# EAGLE design Mic-Breakout_v13 (EAGLE 7.7.0)
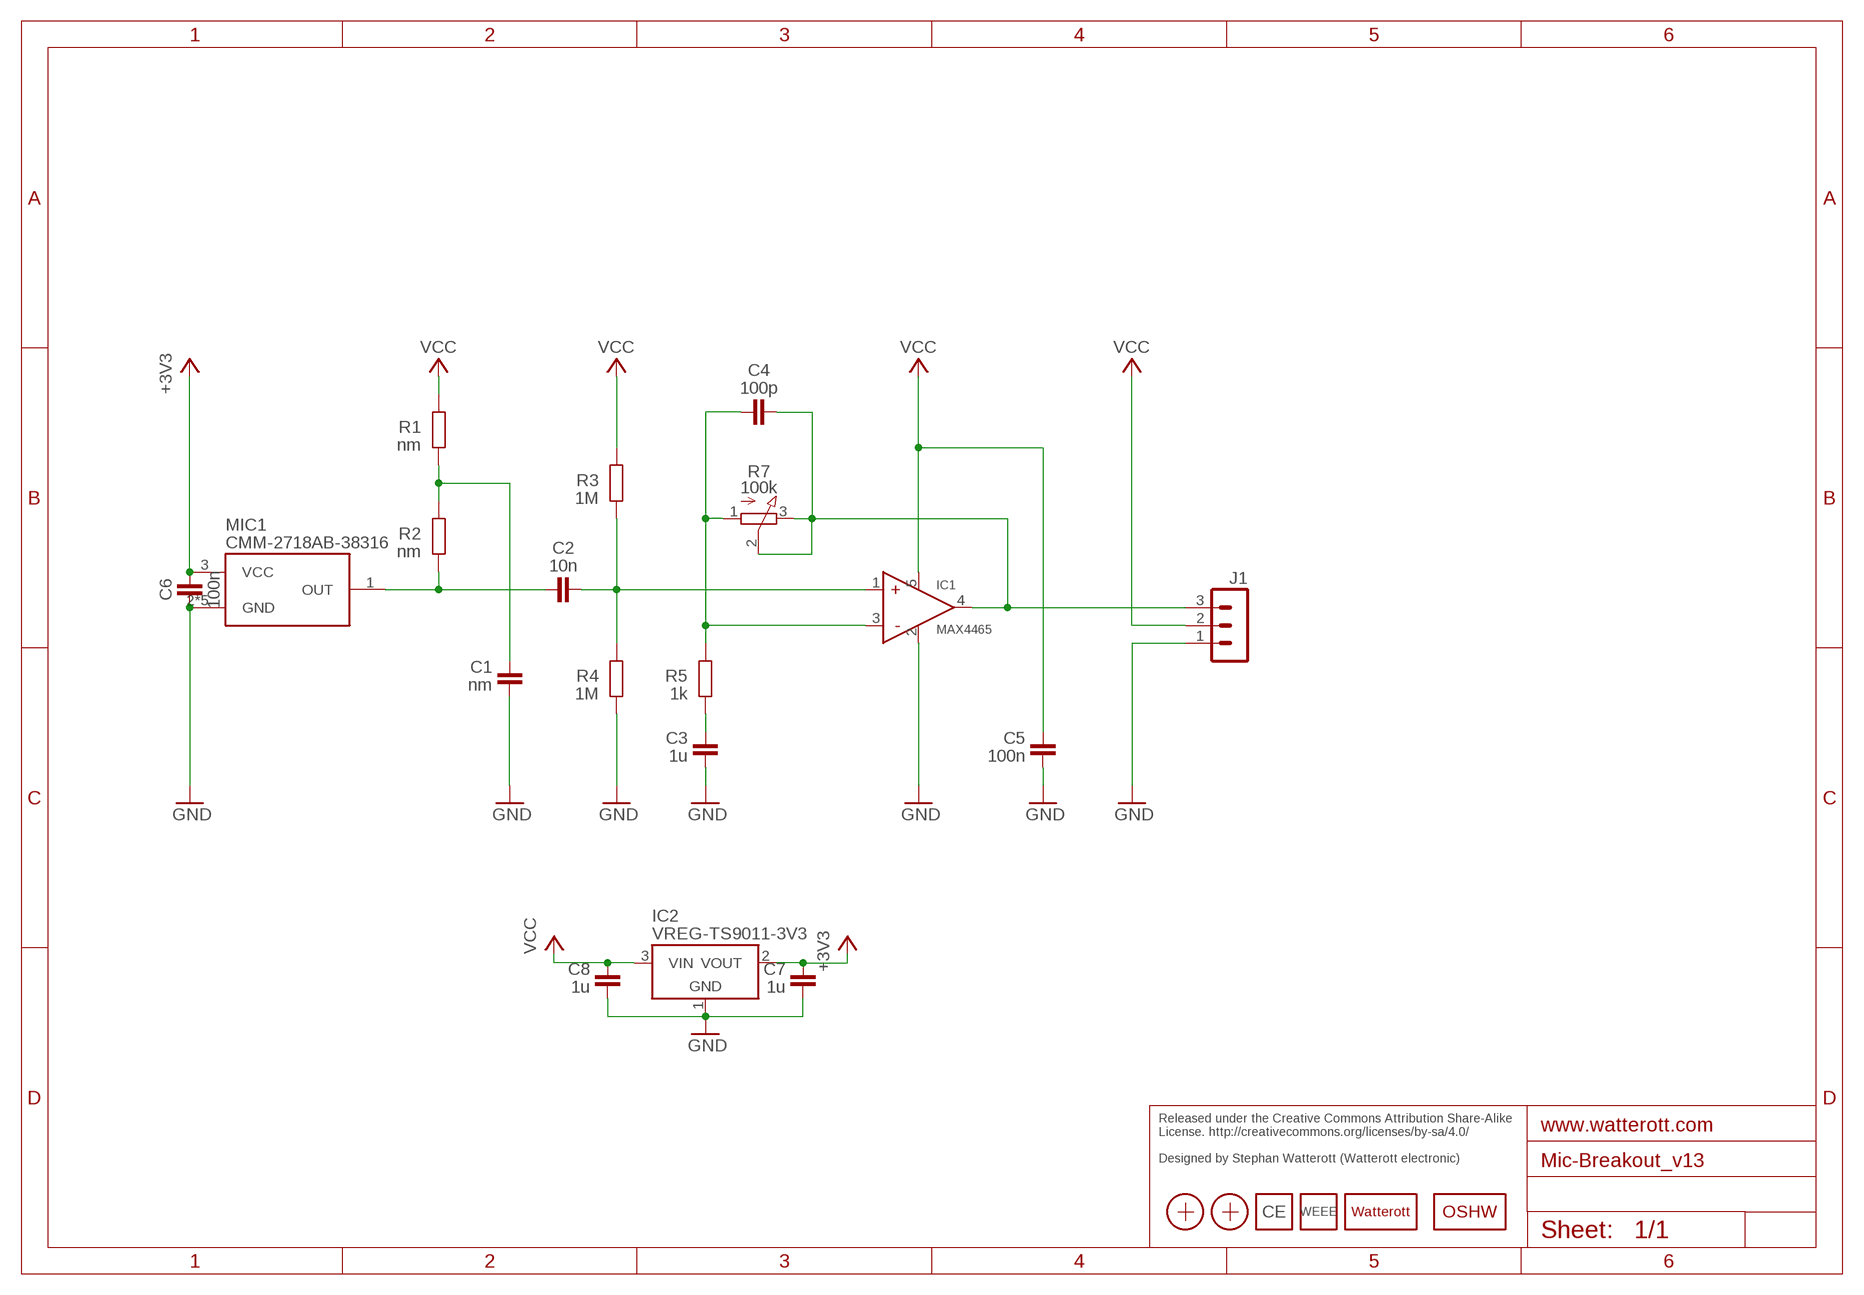
[diagram p0: schematic, sheet 1]

## Parts
C1  nm  CAPACITOR-0402  [C0402]
C2  10n  CAPACITOR-0402  [C0402]
C3  1u  CAPACITOR-0402  [C0402]
C4  100p  CAPACITOR-0402  [C0402]
C5  100n  CAPACITOR-0402  [C0402]
C6  100n  CAPACITOR-0402  [C0402]
C7  1u  CAPACITOR-0402  [C0402]
C8  1u  CAPACITOR-0402  [C0402]
IC1  MAX4465  [SOT353]
IC2  VREG-TS9011-3V3  [SOT23]
J1  MA03-1  [MA03-1]
LOGO1  LOGO-S_PLACE_M  [SPARK_TPLACE_M]
LOGO2  OSHW_LOGOX0100  [OSHW_6X100]
LOGO3  LOGO_WEEE-4  [WEEE_4MM]
LOGO4  LOGO_CE-2  [CE_2MM]
MIC1  CMM-2718AB-38316  CMM-2718AB-38316CMM-2718AB-38316  [CMM-2718AB-38316]
R1  nm  RESISTOR-0402  [C0402]
R2  nm  RESISTOR-0402  [C0402]
R3  1M  RESISTOR-0402  [C0402]
R4  1M  RESISTOR-0402  [C0402]
R5  1k  RESISTOR-0402  [C0402]
R7  100k  POTEVM3Y  [POT_EVM3Y]
X1  PASSER-04  [PASSER_04MM]
X2  PASSER-04  [PASSER_04MM]

## Nets
+3V3: C6.2 C7.2 IC2.2(VOUT) MIC1.3(VCC)
GND: C1.1 C3.1 C5.1 C6.1 C7.1 C8.1 IC1.2(GND) IC2.1(GND) J1.1 MIC1.2(GND) MIC1.4(GND) MIC1.5(GND) MIC1.6(GND) MIC1.7(GND) R4.1
N$1: C1.2 R1.1 R2.2
N$2: C2.2 IC1.1(+) R3.1 R4.2
N$3: C4.1 IC1.4(OUT) J1.3 R7.2(S) R7.3(E)
N$4: C2.1 MIC1.1(OUT) R2.1
N$5: C4.2 IC1.3(-) R5.2 R7.1(A)
N$6: C3.2 R5.1
VCC: C5.2 C8.2 IC1.5(VCC) IC2.3(VIN) J1.2 R1.2 R3.2

## Notes on the sheet
- Released under the Creative Commons Attribution Share-Alike 
  License. http://creativecommons.org/licenses/by-sa/4.0/
  
  Designed by Stephan Watterott (Watterott electronic)

## Library data of the parts
C1-C8 = we-rcl:CAPACITOR: Capacitors ...4.7uF @ 6.3V -> 0402 ...10uF @ 16V -> 0603 ...22uF @ 25V -> 0805
IC1 = we-chip:MAX4465: Maxim MAX4465...MAX4469 OP-Amp for Micro Preamps
IC2 = we-power:VREG: Voltage Regulator LDOs Taiwan Semi TS1117 800mA max 15V - compatible On Semi NCP1117 1A max 20V - compatible Diodes AP2111H 0.6A max 6V (0.25V@0.6A) - compatible Diodes AP2114H 1A max 6V (0.45V@1A) Taiwan Semi TS9011 250mA max 12V - compatible Diodes AP2210 300mA max 15V - compatible Microchip MCP1700 250mA max 6.5V - compatible Microchip MCP1702 250mA max 13V - compatible Microchip MCP1703 250mA max 16V - compatible Microchip MCP1754 150mA max 16V Taiwan Semi TS5204 80mA max 16V (low noise) DC/DC Converter Modules Recom R-78Ex.x-1.0-W36 1A max 28V - compatible CUI V78xx-2000 2A max 18V Murata OKI-78SR-x.x/1.5-W36 1.5A max 36V
J1 = we-con:MA03-1: Pin Header
LOGO1 = we-symbol:LOGO: Watterott electronic Logo
LOGO2 = we-symbol:OSHW_LOGO: Open-Source-Hardware Logo
LOGO3 = we-symbol:LOGO_WEEE: WEEE Logo
LOGO4 = we-symbol:LOGO_CE: CE Logo
MIC1 = we-TESTING:CMM-2718AB-38316
R1-R5 = we-rcl:RESISTOR: Resistors all kinds in 0603 and 0402
R7 = we-rcl:POT: Potentiometer
X1 X2 = we-symbol:PASSER: Fiducial Marker

## Board
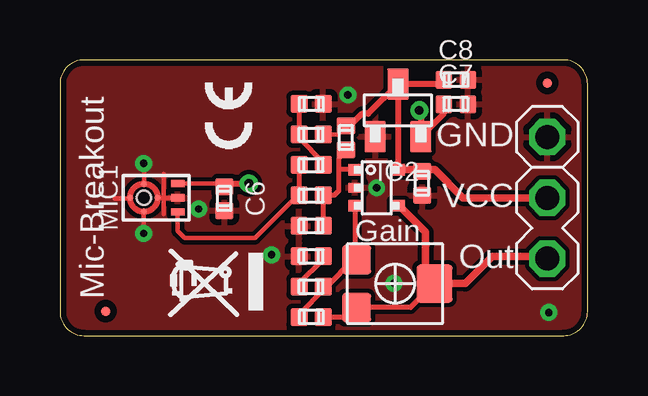
[diagram p1: board, top side]
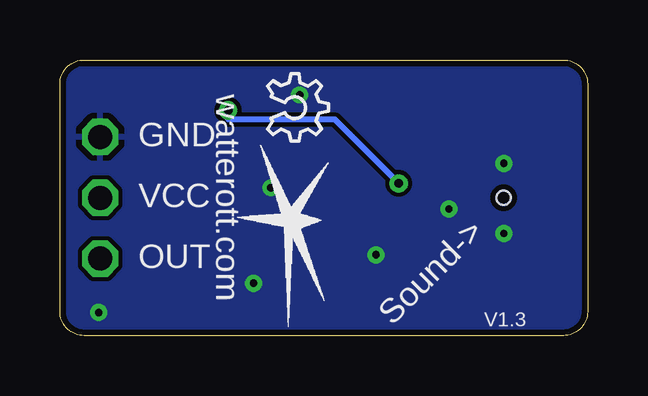
[diagram p2: board, bottom side, seen from below]

Size 22 x 11.5 mm. Coordinates in mm from the lower left corner, seen from the top.
Outline: 1,0 21,0 arc90 22,1 22,10.5 arc90 21,11.5 1,11.5 arc90 0,10.5 0,1 arc90 1,0
Copper layers (1*16): Top 0.035mm / dielectric 1.5mm / Bottom 0.035mm
Design rules "default *": minimum track width 7mil, minimum drill 0.3mm, track to track 7mil, track to pad 7mil, pad to pad 7mil, via to via 7mil, smd to smd 7mil, copper to edge 10mil, drill to drill 8mil, minimum pad ring 10mil, minimum via ring 8mil, stop-mask expansion 4mil, vias tented up to drill 0.5mm, thermal gap 10mil

### Footprints (pad centres in the part's own frame; a part is rotated, then mirrored left to right if it is on the bottom)
C0402 = smd 0.75 x 0.7: 1 0,0.5; 2 0,-0.5
SOT353 = smd 0.6 x 0.5: 1 -0.9,0.75; 3 -0.9,-0.75; 4 0.9,-0.75; 5 0.9,0.75 | smd 0.6 x 0.4: 2 -0.9,0
SOT23 = smd 1.3 x 0.9: 1 -1.1,0.95; 2 -1.1,-0.95; 3 1.1,0
MA03-1 = drill 1 octagon: 1 0,2.54; 2 0,0; 3 0,-2.54
CMM-2718AB-38316 = smd 0.3 x 0.55: 1 -0.59,-0.915; 2 0,-0.915; 3 0.59,-0.915 | smd 0.24 x 0.24: 4 0,-0.07; 5 0,1.07; 6 -0.57,0.5; 7 0.57,0.5 | hole 0.6: 0,0.5
POT_EVM3Y = smd 1.2 x 1.2: 1 -1,-1.6; 3 1,-1.6 | smd 1.6 x 1.5: 2 0,1.65
PASSER_04MM = smd 0.4 x 0.4: X 0,0

### Placement (x,y rotation side)
C1  10.48,9.66 270 top
C2  10.48,5.85 90 top
C3  10.48,3.31 90 top
C4  10.48,0.77 270 top
C5  15.11,6.35 180 top
C6  6.86,5.71 180 top
C7  16.51,9.65 270 top
C8  16.51,10.67 270 top
IC1  13.21,6.17 0 top
IC2  14.1,9.4 90 top
J1  20.32,5.75 0 top
LOGO1  12.38,4.76 270 bottom
LOGO2  13.34,10.93 270 bottom
LOGO3  6.47,2.18 90 top
LOGO4  7.03,9.17 90 top
MIC1  4,5.75 90 top
R1  10.48,8.39 90 top
R2  10.48,7.12 90 top
R3  11.93,8.26 180 top
R4  10.48,4.58 90 top
R5  10.48,2.04 90 top
R7  13.97,2.17 270 top
X1  1.91,1.02 0 top
X2  20.32,10.54 0 top

### Tracks (layer width: path | path; a pad name or v marks a point on that pad's centre or on a via)
+3V3  (via drill 0.35)
  Top 0.178: MIC1.3 6.73,6.34 C6.2
  Top 0.254: C7.2 16.01,9.26 IC2.2 15.05,9.34 v14.99,9.4 | C6.2 6.99,6.35 v7.87,6.35
  Bottom 0.254: v7.87,6.35 10.54,9.02 14.99,9.02 v14.99,9.4
GND  (via drill 0.3)
  Top 0.178: MIC1.6 v3.49,4.26 | MIC1.5 2.9,5.71 2.29,5.71 | MIC1.7 v3.5,7.18 v3.49,7.18 | MIC1.4 4.32,5.75 | 4.32,5.75 MIC1.2 | 4.32,5.75 4.32,5.08 | 4.32,6.73 4.32,5.75
  other vias: 12,10.04 13.21,6.17 5.78,5.28 13.93,2.18 20.38,0.96 8.83,3.37
  pour Bottom: 0,0 0,11.45 21.91,11.45 21.91,0
  pour Top: 0,0.01 0,11.45 21.91,11.45 21.91,0.01
N$1
  Top 0.2: C1.2 R1.1 10,8.37 10,8.22 10.98,7.25 R2.2
N$2
  Top 0.2: R4.2 C2.2 11.43,5.85 11.62,6.04 11.62,6.86 11.62,7.37 R3.1
  Top 0.203: 11.62,6.86 11.68,6.92 IC1.1
N$3
  Top 0.2: C4.1 11.97,0.77 R7.3 14.62,1.17 R7.2
  Top 0.203: 14.14,5.42 IC1.4 | R7.2 15.24,2.55
  Top 0.254: 15.3,3.75 15.24,3.81
  Top 0.305: 14.14,5.42 15.24,4.32 15.24,3.81 15.24,2.55 | R7.2 16.9,2.17 18.03,3.3 20.23,3.3 J1.3
N$4
  Top 0.178: MIC1.1 4.92,4.36 5.21,4.06 8.13,4.06 9.91,5.85 C2.1
  Top 0.2: R2.1 C2.1
  Top 0.406: C2.1 9.84,5.85
N$5
  Top 0.2: R7.1 12.24,3.17 11.11,2.04 R5.2 10.98,1.9 10.03,0.95 10.03,0.83 C4.2
  Top 0.203: R7.1 12.31,3.23 IC1.3
N$6
  Top 0.2: R5.1 9.98,2.17 10.95,3.14 10.95,3.29 C3.2
VCC
  Top 0.178: R3.2 11.56,8.39 R1.2
  Top 0.2: C5.2 15.11,7 15.02,6.92
  Top 0.254: IC1.5 14.11,10.49 IC2.3 | C8.2 15.84,10.5 IC2.3 | IC2.3 12.85,9.25 12.6,9.25 12.1,8.76 R3.2
  Top 0.305: IC1.5 15.02,6.92 15.62,6.92 16.79,5.75 J1.2

### Text on the board
tPlace: GND | Mic-Breakout | VCC | Gain | Out
bPlace: GND | watterott.com | VCC | OUT | V1.3 | Sound->